# EAGLE schematic inktime (EAGLE 9.7.0)

## Sheet 1 of 2
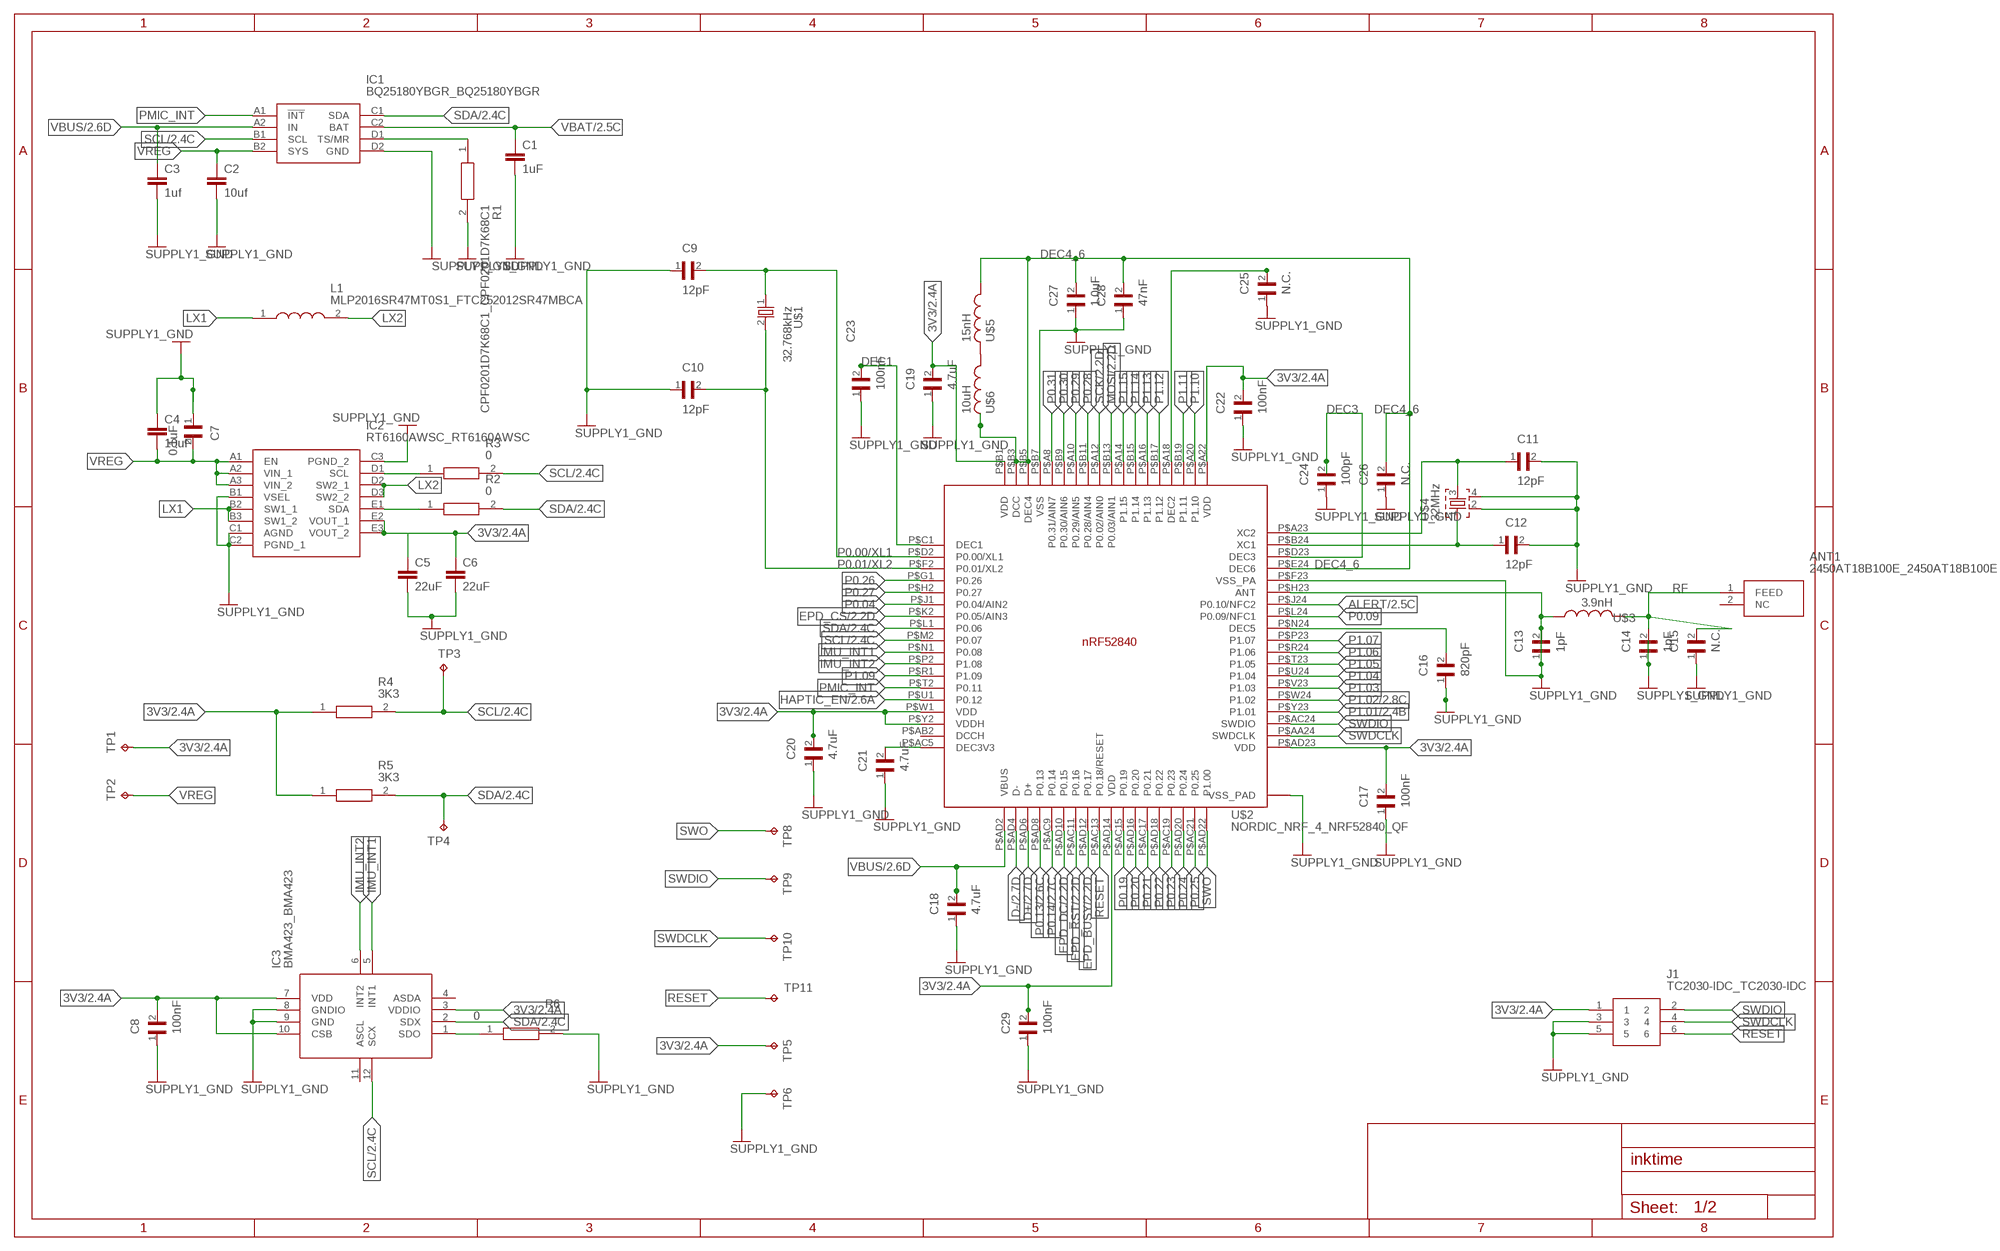
[diagram p0: schematic, sheet 1]

### Parts
ANT1  2450AT18B100E_2450AT18B100E  [2450AT18B100E_ANTC3216X140N]
C1  1uF  PERFECT_0402_CAP_0402  [PERFECT_0402_0402]
C2  10uf  PERFECT_0402_CAP_0402  [PERFECT_0402_0402]
C3  1uf  PERFECT_0402_CAP_0402  [PERFECT_0402_0402]
C4  10uF  PERFECT_0402_CAP_0402  [PERFECT_0402_0402]
C5  22uF  PERFECT_0402_CAP_0402  [PERFECT_0402_0402]
C6  22uF  PERFECT_0402_CAP_0402  [PERFECT_0402_0402]
C7  0.1uF  GRM011R60J152KE01L_1_GRM011R60J152KE01L  [GRM011R60J152KE01L_1_0201]
C8  100nF  GRM011R60J152KE01L_1_GRM011R60J152KE01L  [GRM011R60J152KE01L_1_0201]
C9  12pF  GRM011R60J152KE01L_1_GRM011R60J152KE01L  [GRM011R60J152KE01L_1_0201]
C10  12pF  GRM011R60J152KE01L_1_GRM011R60J152KE01L  [GRM011R60J152KE01L_1_0201]
C11  12pF  GRM011R60J152KE01L_1_GRM011R60J152KE01L  [GRM011R60J152KE01L_1_0201]
C12  12pF  GRM011R60J152KE01L_1_GRM011R60J152KE01L  [GRM011R60J152KE01L_1_0201]
C13  1pF  GRM011R60J152KE01L_1_GRM011R60J152KE01L  [GRM011R60J152KE01L_1_0201]
C14  1pF  GRM011R60J152KE01L_1_GRM011R60J152KE01L  [GRM011R60J152KE01L_1_0201]
C15  N.C.  GRM011R60J152KE01L_1_GRM011R60J152KE01L  [GRM011R60J152KE01L_1_0201]
C16  820pF  GRM011R60J152KE01L_1_GRM011R60J152KE01L  [GRM011R60J152KE01L_1_0201]
C17  100nF  GRM011R60J152KE01L_1_GRM011R60J152KE01L  [GRM011R60J152KE01L_1_0201]
C18  4.7uF  GRM011R60J152KE01L_1_GRM011R60J152KE01L  [GRM011R60J152KE01L_1_0201]
C19  4.7uF  GRM011R60J152KE01L_1_GRM011R60J152KE01L  [GRM011R60J152KE01L_1_0201]
C20  4.7uF  GRM011R60J152KE01L_1_GRM011R60J152KE01L  [GRM011R60J152KE01L_1_0201]
C21  4.7uF  GRM011R60J152KE01L_1_GRM011R60J152KE01L  [GRM011R60J152KE01L_1_0201]
C22  100nF  GRM011R60J152KE01L_1_GRM011R60J152KE01L  [GRM011R60J152KE01L_1_0201]
C23  100nF  GRM011R60J152KE01L_1_GRM011R60J152KE01L  [GRM011R60J152KE01L_1_0201]
C24  100pF  GRM011R60J152KE01L_1_GRM011R60J152KE01L  [GRM011R60J152KE01L_1_0201]
C25  N.C.  GRM011R60J152KE01L_1_GRM011R60J152KE01L  [GRM011R60J152KE01L_1_0201]
C26  N.C.  GRM011R60J152KE01L_1_GRM011R60J152KE01L  [GRM011R60J152KE01L_1_0201]
C27  1.0uF  GRM011R60J152KE01L_1_GRM011R60J152KE01L  [GRM011R60J152KE01L_1_0201]
C28  47nF  GRM011R60J152KE01L_1_GRM011R60J152KE01L  [GRM011R60J152KE01L_1_0201]
C29  100nF  GRM011R60J152KE01L_1_GRM011R60J152KE01L  [GRM011R60J152KE01L_1_0201]
IC1  BQ25180YBGR_BQ25180YBGR  [BQ25180YBGR_BGA8C40P2X4_100X155X50]
IC2  RT6160AWSC_RT6160AWSC  [RT6160AWSC_BGA15C40P3X5_140X230X60]
IC3  BMA423_BMA423  [BMA423_BMA423]
J1  TC2030-IDC_TC2030-IDC  [TC2030-IDC_TC2030IDC]
L1  MLP2016SR47MT0S1_FTC252012SR47MBCA  [MLP2016SR47MT0S1_INDC2016X100N]
R1  CPF0201D7K68C1_CPF0201D7K68C1  [CPF0201D7K68C1_0201]
R2  0  CPF0201D7K68C1_CPF0201D7K68C1  [CPF0201D7K68C1_0201]
R3  0  CPF0201D7K68C1_CPF0201D7K68C1  [CPF0201D7K68C1_0201]
R4  3K3  CPF0201D7K68C1_CPF0201D7K68C1  [CPF0201D7K68C1_0201]
R5  3K3  CPF0201D7K68C1_CPF0201D7K68C1  [CPF0201D7K68C1_0201]
R6  0  CPF0201D7K68C1_CPF0201D7K68C1  [CPF0201D7K68C1_0201]
TP1  HECTOR_WATCH_1_TPTP20R  [HECTOR_WATCH_1_TP20R]
TP2  HECTOR_WATCH_1_TPTP20R  [HECTOR_WATCH_1_TP20R]
TP3  HECTOR_WATCH_1_TPTP20R  [HECTOR_WATCH_1_TP20R]
TP4  HECTOR_WATCH_1_TPTP20R  [HECTOR_WATCH_1_TP20R]
TP5  HECTOR_WATCH_1_TPTP20R  [HECTOR_WATCH_1_TP20R]
TP6  HECTOR_WATCH_1_TPTP20R  [HECTOR_WATCH_1_TP20R]
TP8  HECTOR_WATCH_1_TPTP20R  [HECTOR_WATCH_1_TP20R]
TP9  HECTOR_WATCH_1_TPTP20R  [HECTOR_WATCH_1_TP20R]
TP10  HECTOR_WATCH_1_TPTP20R  [HECTOR_WATCH_1_TP20R]
TP11  HECTOR_WATCH_1_TPTP20R  [HECTOR_WATCH_1_TP20R]
U$1  32.768kHz  NORDIC_NRF_1_XTAL_32KHZ  [NORDIC_NRF_1_XTAL_3215_N]
U$2  NORDIC_NRF_4_NRF52840_QF  [NORDIC_NRF_4_AQFN50P700X700X85_HS-74N]
U$3  3.9nH  NORDIC_NRF_2_INDUCTOR_0402_L  [NORDIC_NRF_2_RESC0402_L]
U$4  32MHz  NORDIC_NRF_XTAL_32MHZ  [NORDIC_NRF_BT-XTAL_2016_N]
U$5  15nH  NORDIC_NRF_2_INDUCTOR_0402_L  [NORDIC_NRF_2_RESC0402_L]
U$6  10uH  NORDIC_NRF_2_INDUCTOR_0402_L  [NORDIC_NRF_2_RESC0402_L]

### Nets
3V3/2.4A: C5.1 C6.1 C8.2 C17.2 C22.2 IC2.E2(VOUT_1) IC2.E3(VOUT_2) IC3.3(VDDIO) IC3.7(VDD) IC3.10(CSB) J1.1 R4.1 R5.1 TP1.TP TP5.TP U$2.P$A22(VDD) U$2.P$AD14(VDD) U$2.P$AD23(VDD) U$2.P$B1(VDD) U$2.P$W1(VDD) U$2.P$Y2(VDDH)
3V3/2.4A1: C18.2
3V3/2.4A2: C20.2
3V3/2.4A3: C21.2 U$2.P$AC5(DEC3V3)
3V3/2.4A4: C23.2
3V3/2.4A5: C19.2
3V3/2.4A6: C24.2
3V3/2.4A7: C25.2
3V3/2.4A8: C29.2
ALERT/2.5C: U$2.P$J24(P0.10/NFC2)
D+/2.7D: U$2.P$AD6(D+)
D-/2.7D: U$2.P$AD4(D-)
DEC1: U$2.P$C1(DEC1)
DEC3: U$2.P$D23(DEC3)
DEC4_6: C26.2 C27.2 C28.2 U$2.P$B3(DCC) U$2.P$B5(DEC4) U$2.P$E24(DEC6) U$5.1 U$6.2
EPD_BUSY/2.2D: U$2.P$AD12(P0.17)
EPD_CS/2.2D: U$2.P$K2(P0.05/AIN3)
EPD_DC/2.2D: U$2.P$AD10(P0.15)
EPD_RST/2.2D: U$2.P$AC11(P0.16)
GND: C1.2 C2.2 C3.2 C4.1 C5.2 C6.2 C7.1 C8.1 C9.1 C10.1 C11.2 C12.2 C13.1 C13.2 C14.1 C15.1 C16.1 C17.1 C18.1 C19.1 C20.1 C21.1 C22.1 C23.1 C24.1 C25.1 C26.1 C27.1 C28.1 C29.1 IC1.D2(GND) IC2.B1(VSEL) IC2.C1(AGND) IC2.C2(PGND_1) IC2.C3(PGND_2) IC3.8(GNDIO) IC3.9(GND) J1.3 J1.5 R1.2 R6.2 TP6.TP U$2.P$74(VSS_PAD) U$2.P$75(VSS_PAD) U$2.P$76(VSS_PAD) U$2.P$77(VSS_PAD) U$2.P$78(VSS_PAD) U$2.P$79(VSS_PAD) U$2.P$80(VSS_PAD) U$2.P$81(VSS_PAD) U$2.P$82(VSS_PAD) U$2.P$83(VSS_PAD) U$2.P$84(VSS_PAD) U$2.P$85(VSS_PAD) U$2.P$86(VSS_PAD) U$2.P$87(VSS_PAD) U$2.P$88(VSS_PAD) U$2.P$89(VSS_PAD) U$2.P$90(VSS_PAD) U$2.P$B7(VSS) U$2.P$F23(VSS_PA) U$2.P$H23(ANT) U$3.1 U$4.2 U$4.4 ; supply symbol labelled SUPPLY1_GND ; also sheet 2
HAPTIC_EN/2.6A: U$2.P$U1(P0.12)
IMU_INT1: IC3.5(INT1) U$2.P$N1(P0.08)
IMU_INT2: IC3.6(INT2) U$2.P$P2(P1.08)
LX1: IC2.B2(SW1_1) IC2.B3(SW1_2) L1.1
LX2: IC2.D2(SW2_1) IC2.D3(SW2_2) L1.2
MOSI/2.2D: U$2.P$B13(P0.03/AIN1)
N$1: IC1.D1(TS/MR) R1.1
N$2: IC2.E1(SDA) R2.1
N$3: IC3.1(SDO) R6.1
N$4: IC2.D1(SCL) R3.1
N$5: U$5.2 U$6.1
N$6: C11.1 U$2.P$A23(XC2) U$4.3
N$7: C12.1 U$2.P$B24(XC1) U$4.1
N$8: C16.2 U$2.P$N24(DEC5)
N$10: U$2.P$A18(DEC2)
P0.00/XL1: C9.2 U$1.1 U$2.P$D2(P0.00/XL1)
P0.01/XL2: C10.2 U$1.2 U$2.P$F2(P0.01/XL2)
P0.04: U$2.P$J1(P0.04/AIN2)
P0.09: U$2.P$L24(P0.09/NFC1)
P0.13/2.6C: U$2.P$AD8(P0.13)
P0.14/2.7C: U$2.P$AC9(P0.14)
P0.19: U$2.P$AC15(P0.19)
P0.20: U$2.P$AD16(P0.20)
P0.21: U$2.P$AC17(P0.21)
P0.22: U$2.P$AD18(P0.22)
P0.23: U$2.P$AC19(P0.23)
P0.24: U$2.P$AD20(P0.24)
P0.25: U$2.P$AC21(P0.25)
P0.26: U$2.P$G1(P0.26)
P0.27: U$2.P$H2(P0.27)
P0.28: U$2.P$B11(P0.28/AIN4)
P0.29: U$2.P$A10(P0.29/AIN5)
P0.30: U$2.P$B9(P0.30/AIN6)
P0.31: U$2.P$A8(P0.31/AIN7)
P1.01/2.4B: U$2.P$Y23(P1.01)
P1.02/2.8C: U$2.P$W24(P1.02)
P1.03: U$2.P$V23(P1.03)
P1.04: U$2.P$U24(P1.04)
P1.05: U$2.P$T23(P1.05)
P1.06: U$2.P$R24(P1.06)
P1.07: U$2.P$P23(P1.07)
P1.09: U$2.P$R1(P1.09)
P1.10: U$2.P$A20(P1.10)
P1.11: U$2.P$B19(P1.11)
P1.12: U$2.P$B17(P1.12)
P1.13: U$2.P$A16(P1.13)
P1.14: U$2.P$B15(P1.14)
P1.15: U$2.P$A14(P1.15)
PMIC_INT: IC1.A1(!INT) U$2.P$T2(P0.11)
RESET: J1.6 TP11.TP U$2.P$AC13(P0.18/RESET)
RF: ANT1.1(FEED) C14.2 C15.2 U$3.2
SCK/2.2D: U$2.P$A12(P0.02/AIN0)
SCL/2.4C: IC1.B1(SCL) IC3.12(SCX) R3.2 R4.2 TP3.TP U$2.P$M2(P0.07)
SDA/2.4C: IC1.C1(SDA) IC3.2(SDX) R2.2 R5.2 TP4.TP U$2.P$L1(P0.06)
SWDCLK: J1.4 TP10.TP U$2.P$AA24(SWDCLK)
SWDIO: J1.2 TP9.TP U$2.P$AC24(SWDIO)
SWO: TP8.TP U$2.P$AD22(P1.00)
VBAT/2.5C: C1.1 IC1.C2(BAT)
VBUS/2.6D: C3.1 IC1.A2(IN) U$2.P$AD2(VBUS)
VREG: C2.1 C4.2 C7.2 IC1.B2(SYS) IC2.A1(EN) IC2.A2(VIN_1) IC2.A3(VIN_2) TP2.TP
Unconnected: ANT1.2(NC) IC3.4(ASDA) IC3.11(ASCL) U$2.P$AB2(DCCH)

## Sheet 2 of 2
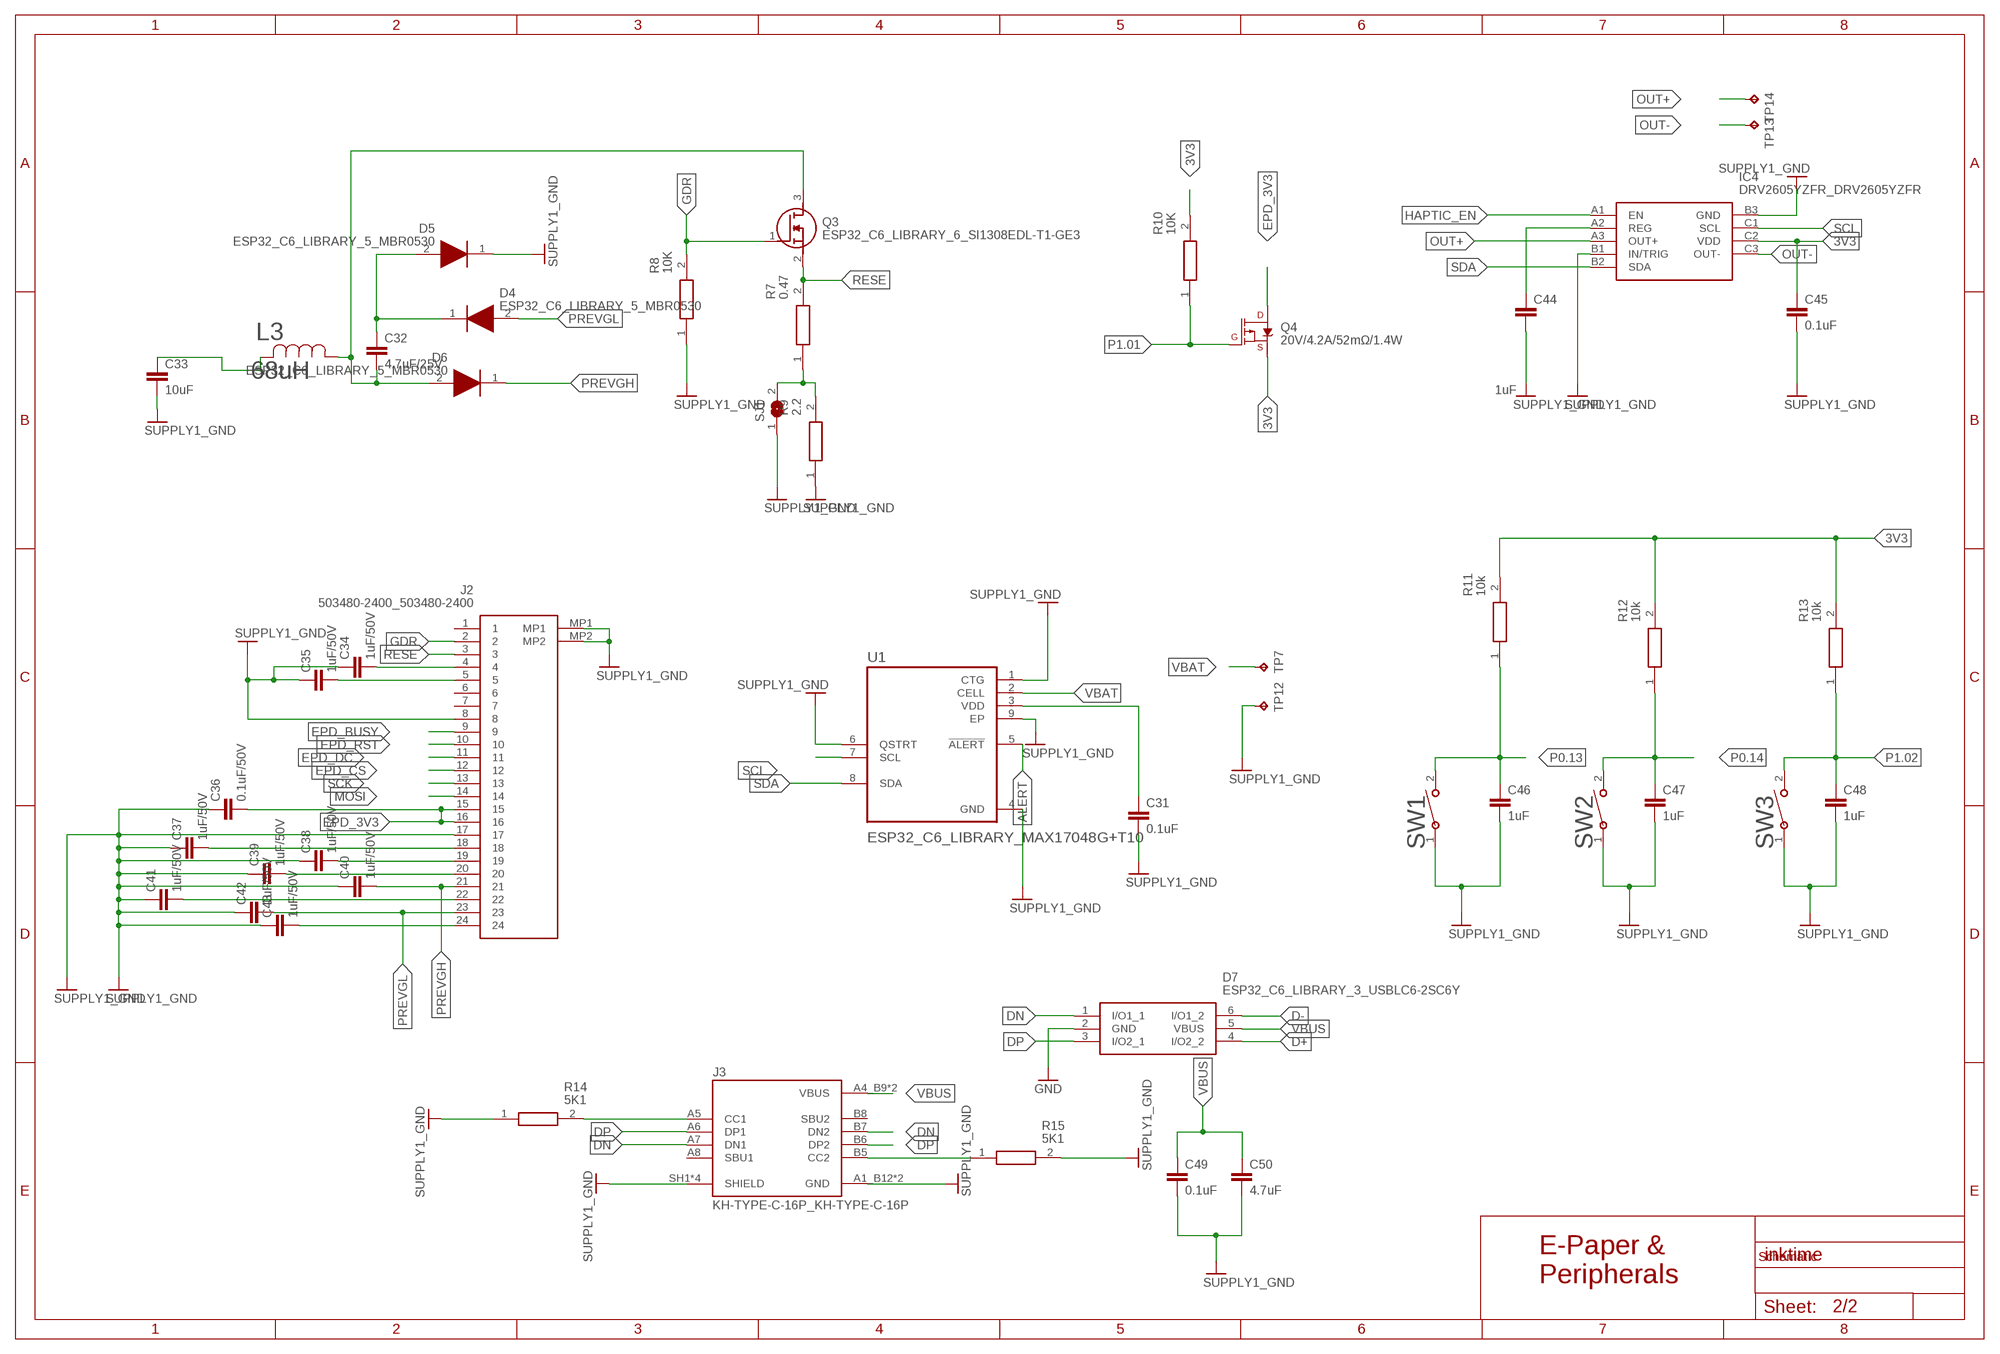
[diagram p1: schematic, sheet 2]

### Parts
C31  0.1uF  PERFECT_0402_CAP_0402  [PERFECT_0402_0402]
C32  4.7uF/25V  PERFECT_0402_CAP_0402  [PERFECT_0402_0402]
C33  10uF  PERFECT_0402_CAP_0402  [PERFECT_0402_0402]
C34  1uF/50V  PERFECT_0402_CAP_0402  [PERFECT_0402_0402]
C35  1uF/50V  PERFECT_0402_CAP_0402  [PERFECT_0402_0402]
C36  0.1uF/50V  PERFECT_0402_CAP_0402  [PERFECT_0402_0402]
C37  1uF/50V  PERFECT_0402_CAP_0402  [PERFECT_0402_0402]
C38  1uF/50V  PERFECT_0402_CAP_0402  [PERFECT_0402_0402]
C39  1uF/50V  PERFECT_0402_CAP_0402  [PERFECT_0402_0402]
C40  1uF/50V  PERFECT_0402_CAP_0402  [PERFECT_0402_0402]
C41  1uF/50V  PERFECT_0402_CAP_0402  [PERFECT_0402_0402]
C42  1uF/50V  PERFECT_0402_CAP_0402  [PERFECT_0402_0402]
C43  1uF/50V  PERFECT_0402_CAP_0402  [PERFECT_0402_0402]
C44  1uF  PERFECT_0402_CAP_0402  [PERFECT_0402_0402]
C45  0.1uF  PERFECT_0402_CAP_0402  [PERFECT_0402_0402]
C46  1uF  PERFECT_0402_CAP_0402  [PERFECT_0402_0402]
C47  1uF  PERFECT_0402_CAP_0402  [PERFECT_0402_0402]
C48  1uF  PERFECT_0402_CAP_0402  [PERFECT_0402_0402]
C49  0.1uF  PERFECT_0402_CAP_0402  [PERFECT_0402_0402]
C50  4.7uF  PERFECT_0402_CAP_0402  [PERFECT_0402_0402]
D4  ESP32_C6_LIBRARY_5_MBR0530  [ESP32_C6_LIBRARY_5_SOD3716X135N]
D5  ESP32_C6_LIBRARY_5_MBR0530  [ESP32_C6_LIBRARY_5_SOD3716X135N]
D6  ESP32_C6_LIBRARY_5_MBR0530  [ESP32_C6_LIBRARY_5_SOD3716X135N]
D7  ESP32_C6_LIBRARY_3_USBLC6-2SC6Y  [ESP32_C6_LIBRARY_3_SOT95P280X145-6N]
IC4  DRV2605YZFR_DRV2605YZFR  [DRV2605YZFR_BGA9C50P3X3_144X144X62]
J2  503480-2400_503480-2400  [503480-2400_5034802400]
J3  KH-TYPE-C-16P_KH-TYPE-C-16P  [KH-TYPE-C-16P_KINGHELM_KH-TYPE-C-16P]
L3  68uH  ESP32_C6_LIBRARY_2_744043680IND_4828-WE-TPC_WRE  [ESP32_C6_LIBRARY_2_IND_4828-WE-TPC_WRE]
Q3  ESP32_C6_LIBRARY_6_SI1308EDL-T1-GE3  [ESP32_C6_LIBRARY_6_SOT65P210X110-3N]
Q4  20V/4.2A/52mΩ/1.4W  ESP32_C6_LIBRARY_4_ESP32_WROVER_SPARKFUN-DISCRETESEMI_MOSFET_PCH-DMG2305UX-7  [ESP32_C6_LIBRARY_4_ESP32_C6_LIBRARY_4_ESP32_C6_LIBRARY_4_ESP32_C6_LIBRARY_4_ESP32_WROVER_SPARKFUN-DISCRETESEMI_SOT23-3]
R7  0.47  CPF0201D7K68C1_CPF0201D7K68C1  [CPF0201D7K68C1_0201]
R8  10K  CPF0201D7K68C1_CPF0201D7K68C1  [CPF0201D7K68C1_0201]
R9  2.2  CPF0201D7K68C1_CPF0201D7K68C1  [CPF0201D7K68C1_0201]
R10  10K  CPF0201D7K68C1_CPF0201D7K68C1  [CPF0201D7K68C1_0201]
R11  10k  CPF0201D7K68C1_CPF0201D7K68C1  [CPF0201D7K68C1_0201]
R12  10k  CPF0201D7K68C1_CPF0201D7K68C1  [CPF0201D7K68C1_0201]
R13  10k  CPF0201D7K68C1_CPF0201D7K68C1  [CPF0201D7K68C1_0201]
R14  5K1  CPF0201D7K68C1_CPF0201D7K68C1  [CPF0201D7K68C1_0201]
R15  5K1  CPF0201D7K68C1_CPF0201D7K68C1  [CPF0201D7K68C1_0201]
SJ1  ESP32_C6_LIBRARY_7_JUMPER_SJ  [ESP32_C6_LIBRARY_7_JUMPER_SJ]
SW1  2025-10-22_07-23-44_LIBRARY_EVP-AKE31ASW_EVP-AKE31A_PAN  [2025-10-22_07-23-44_LIBRARY_SW_EVP-AKE31A_PAN]
SW2  2025-10-22_07-23-44_LIBRARY_EVP-AKE31ASW_EVP-AKE31A_PAN  [2025-10-22_07-23-44_LIBRARY_SW_EVP-AKE31A_PAN]
SW3  2025-10-22_07-23-44_LIBRARY_EVP-AKE31ASW_EVP-AKE31A_PAN  [2025-10-22_07-23-44_LIBRARY_SW_EVP-AKE31A_PAN]
TP7  HECTOR_WATCH_1_TPTP20R  [HECTOR_WATCH_1_TP20R]
TP12  HECTOR_WATCH_1_TPTP20R  [HECTOR_WATCH_1_TP20R]
TP13  HECTOR_WATCH_1_TPTP20R  [HECTOR_WATCH_1_TP20R]
TP14  HECTOR_WATCH_1_TPTP20R  [HECTOR_WATCH_1_TP20R]
U1  ESP32_C6_LIBRARY_MAX17048G+T10  [ESP32_C6_LIBRARY_SON50P200X200X80-9N]

### Nets
3V3: C45.1 IC4.C2(VDD) Q4.2(S) R10.2 R11.2 R12.2 R13.2
ALERT: U1.5(!ALERT)
D+: D7.4(I/O2_2)
D-: D7.6(I/O1_2)
DN: D7.1(I/O1_1) J3.A7(DN1) J3.B7(DN2)
DP: D7.3(I/O2_1) J3.A6(DP1) J3.B6(DP2)
EPD_3V3: C36.2 J2.15 J2.16 Q4.3(D)
EPD_BUSY: J2.9
EPD_CS: J2.12
EPD_DC: J2.11
EPD_RST: J2.10
GDR: J2.2 Q3.1(G) R8.2
GND: C31.2 C33.2 C34.1 C35.1 C36.1 C37.1 C38.1 C39.1 C40.1 C41.1 C42.1 C43.1 C44.2 C45.2 C46.2 C47.2 C48.2 C49.2 C50.2 D5.1(K) D7.2(GND) IC4.B1(IN/TRIG) IC4.B3(GND) J2.8 J2.17 J2.MP1 J2.MP2 J3.A1_B12(GND) J3.A12_B1(GND) J3.SH1(SHIELD) J3.SH2(SHIELD) J3.SH3(SHIELD) J3.SH4(SHIELD) R8.1 R9.1 R14.1 R15.2 SJ1.1 SW1.1 SW2.1 SW3.1 TP12.TP U1.1(CTG) U1.4(GND) U1.6(QSTRT) U1.9(EP) ; supply symbol labelled SUPPLY1_GND ; also sheet 1
HAPTIC_EN: IC4.A1(EN)
MOSI: J2.14
N$15: C33.1 L3.2
N$16: C32.2 D6.2(A) L3.1 Q3.3(D)
N$17: C32.1 D4.1(K) D5.2(A)
N$18: C34.2 J2.4
N$19: C31.1 U1.3(VDD)
N$20: C35.2 J2.5
N$21: C44.1 IC4.A2(REG)
N$23: R7.1 R9.2 SJ1.2
N$24: C37.2 J2.18
N$25: C38.2 J2.19
N$26: C39.2 J2.20
N$27: J3.B5(CC2) R15.1
N$28: C41.2 J2.22
N$29: J3.A5(CC1) R14.2
N$30: C43.2 J2.24
OUT+: IC4.A3(OUT+) TP14.TP
OUT-: IC4.C3(OUT-) TP13.TP
P0.13: C46.1 R11.1 SW1.2
P0.14: C47.1 R12.1 SW2.2
P1.01: Q4.1(G) R10.1
P1.02: C48.1 R13.1 SW3.2
PREVGH: C40.2 D6.1(K) J2.21
PREVGL: C42.2 D4.2(A) J2.23
RESE: J2.3 Q3.2(S) R7.2
SCK: J2.13
SCL: IC4.C1(SCL) U1.7(SCL)
SDA: IC4.B2(SDA) U1.8(SDA)
VBAT: TP7.TP U1.2(CELL)
VBUS: C49.1 C50.1 D7.5(VBUS) J3.A4_B9(VBUS) J3.A9_B4(VBUS)
Unconnected: J2.1 J2.6 J2.7 J3.A8(SBU1) J3.B8(SBU2)

### Notes on the sheet
- Schematic
- E-Paper & 
  Peripherals

## Library data of the parts
ANT1 = InkTime_v5:2450AT18B100E_2450AT18B100E: Antennas 2.45GHz ANTENNA Source: Datasheet <https://www.johansontechnology.com/datasheets/2450AT18B100/2450AT18B100.pdf>
C1-C6 C31-C50 = InkTime_v5:PERFECT_0402_CAP_0402: 0402 (1005 Metric) Nick Garner - TeleSense
C7-C29 = InkTime_v5:GRM011R60J152KE01L_1_GRM011R60J152KE01L: Check availability <https://pricing.snapeda.com/parts/GRM011R60J152KE01L/Murata/view-part?ref=eda>
D4-D6 = InkTime_v5:ESP32_C6_LIBRARY_5_MBR0530: ON SEMICONDUCTOR - MBR0530 - DIODE, SCHOTTKY, 0.5A, 30V, SOD-123 Source: Datasheet <http://www.onsemi.com/pub/Collateral/MBR0530T1-D.PDF> Check availability <https://pricing.snapeda.com/parts/MBR0530/ON%20Semiconductor/view-part?ref=eda>
D7 = InkTime_v5:ESP32_C6_LIBRARY_3_USBLC6-2SC6Y: Low Cap. ESD Protection Auto SOT-23-6 STMicroelectronics USBLC6-2SC6Y, Dual Uni-Directional TVS Diode Array, 6-Pin SOT-23 Source: Datasheet <https://componentsearchengine.com/Datasheets/1/USBLC6-2SC6Y.pdf> Check availability <https://pricing.snapeda.com/parts/USBLC6-2SC6Y/STMicroelectronics/view-part?ref=eda>
IC1 = InkTime_v5:BQ25180YBGR_BQ25180YBGR: Charger IC Lithium Ion/Polymer, Lithium Iron Phosphate 8-DSBGA (1.6x1.1) Source: Datasheet <https://www.ti.com/lit/ds/symlink/bq25180.pdf?ts=1650264094470&ref_url=https%3A%2F%2Fwww.ti.com%2Fproduct%2FBQ25180>
IC2 = InkTime_v5:RT6160AWSC_RT6160AWSC: Buck-Boost Regulator Positive Output Step-Up/Step-Down I2C DC-DC Controller IC 15-WL-CSP (BSC) (1.4x2.3) Source: Datasheet <https://www.richtek.com/SaveDownload.aspx?specid=RT6160A>
IC3 = InkTime_v5:BMA423_BMA423: Accelerometers Triaxial low-g 12bit Acceleration Sensor Source: Datasheet <https://www.mouser.com/datasheet/2/783/BST-BMA423-DS000-1509600.pdf>
IC4 = InkTime_v5:DRV2605YZFR_DRV2605YZFR: Haptic Driver for ERM/LRA with Built-In Library and Smart Loop Architecture Source: Datasheet <http://www.ti.com/lit/gpn/drv2605>
J1 = InkTime_v5:TC2030-IDC_TC2030-IDC: CABLE ADAPTER 6 POS Source: Datasheet <https://datasheet.datasheetarchive.com/originals/distributors/Datasheets_SAMA/62bc384e093448baaaa63dbd0b9d8707.pdf>
J2 = InkTime_v5:503480-2400_503480-2400: FFC & FPC Connectors 0.5mm FPC RA SMT Dual Contact 24Ckt Source: Datasheet <https://componentsearchengine.com/Datasheets/1/503480-2400.pdf>
J3 = InkTime_v5:KH-TYPE-C-16P_KH-TYPE-C-16P: Check availability <https://pricing.snapeda.com/parts/KH-TYPE-C-16P/kinghelm/view-part?ref=eda>
L1 = InkTime_v5:MLP2016SR47MT0S1_FTC252012SR47MBCA: SMD / SMT Inductors (Coils), L=0.47?H, L x W x T : Source: Datasheet <https://product.tdk.com/system/files/dam/doc/product/inductor/inductor/smd/catalog/inductor_commercial_power_mlp2016_en.pdf>
L3 = InkTime_v5:ESP32_C6_LIBRARY_2_744043680
Q3 = InkTime_v5:ESP32_C6_LIBRARY_6_SI1308EDL-T1-GE3: MOSFET N-Ch 30V 1.5A TrenchFET SC70 Vishay Si1308EDL-T1-GE3 N-channel MOSFET Transistor, 1.5 A, 30 V, 3-Pin SC-70 Source: Datasheet <https://componentsearchengine.com/Datasheets/1/SI1308EDL-T1-GE3.pdf> Check availability <https://pricing.snapeda.com/parts/SI1308EDL-T1-GE3/Vishay%20Siliconix/view-part?ref=eda>
Q4 = InkTime_v5:ESP32_C6_LIBRARY_4_ESP32_WROVER_SPARKFUN-DISCRETESEMI_MOSFET_PCH: P-channel MOSFETs Voltage controlled devices that allow control of high current outputs. SparkFun Products: SparkFun ESP32 Thing <https://www.sparkfun.com/products/13907> SparkFun ESP8266 Thing <https://www.sparkfun.com/products/13231> SparkFun Pi Servo HAT V2 <https://www.sparkfun.com/products/15316> DMG2305UX-7 (20V/4.2A/SOT23-3)
R1-R15 = InkTime_v5:CPF0201D7K68C1_CPF0201D7K68C1: 7.68k 0201 Thin Film Surface Mount Fixed Resistor +/-0.5% 0.031W CPF0201D7K68C1 Source: Datasheet <http://www.te.com/commerce/DocumentDelivery/DDEController?Action=showdoc&DocId=Data Sheet1773200-1ApdfEnglishENG_DS_1773200-1_A.pdf4-2176215-6>
SJ1 = InkTime_v5:ESP32_C6_LIBRARY_7_JUMPER_SJ: SMD solder JUMPER
SW1-SW3 = InkTime_v5:2025-10-22_07-23-44_LIBRARY_EVP-AKE31A
TP1-TP14 = InkTime_v5:HECTOR_WATCH_1_TP: Test pad
U1 = InkTime_v5:ESP32_C6_LIBRARY_MAX17048G+T10: Check availability <https://pricing.snapeda.com/parts/MAX17048G%2BT10/Analog%20Devices/view-part?ref=eda>
U$1 = InkTime_v5:NORDIC_NRF_1_XTAL_32KHZ
U$2 = InkTime_v5:NORDIC_NRF_4_NRF52840_QF: nRF52840 Features Advanced Single chip 2.4 GHz multi-protocol SoC 32-bit ARM Cortex-M4F Processor 1.7v to 5.5v operation 1MB flash + 256kB RAM Bluetooth 5 support for long range and high throughput 802.15.4 radio support On-chip NFC PPI –Programmable Peripheral Interconnect Automated power management system with automatic power management of each peripheral Configurable I/O mapping for analog and digital I/O 48 x GPIO 1 x QSPI 4 x Master/Slave SPI 2 x Two-wire interface (I²C) I²S interface 2 x UART 4 x PWM USB 2.0 controller ARM TrustZone CryptoCell-310 Cryptographic and security module AES 128-bit ECB/CCM/AAR hardware accelerator Digital microphone interface (PDM) Quadrature decoder 12-bit ADC Low power comparator On-chip 50Ω balun On-air compatible with nRF52, nRF51 and nRF24 Series Applications Advanced high performance wearables Wearables for secure payments Virtual Reality/Augmented Reality systems Smart Home sensor networks Smart city sensor networks High performance HID controllers Internet of Things (IoT) sensor networks Smart door locks Smart lighting networks Connected white goods
U$3 U$5 U$6 = InkTime_v5:NORDIC_NRF_2_INDUCTOR: Generic chip inductor
U$4 = InkTime_v5:NORDIC_NRF_XTAL_32MHZ